# Altium schematic sheet OMD_F7_MCU.SchDoc
size A2; Organization: Altium Limited; Address1: L3, 12a Rodborough Rd; Address2: Frenchs Forest; Address3: NSW; Address4: Australia 2086
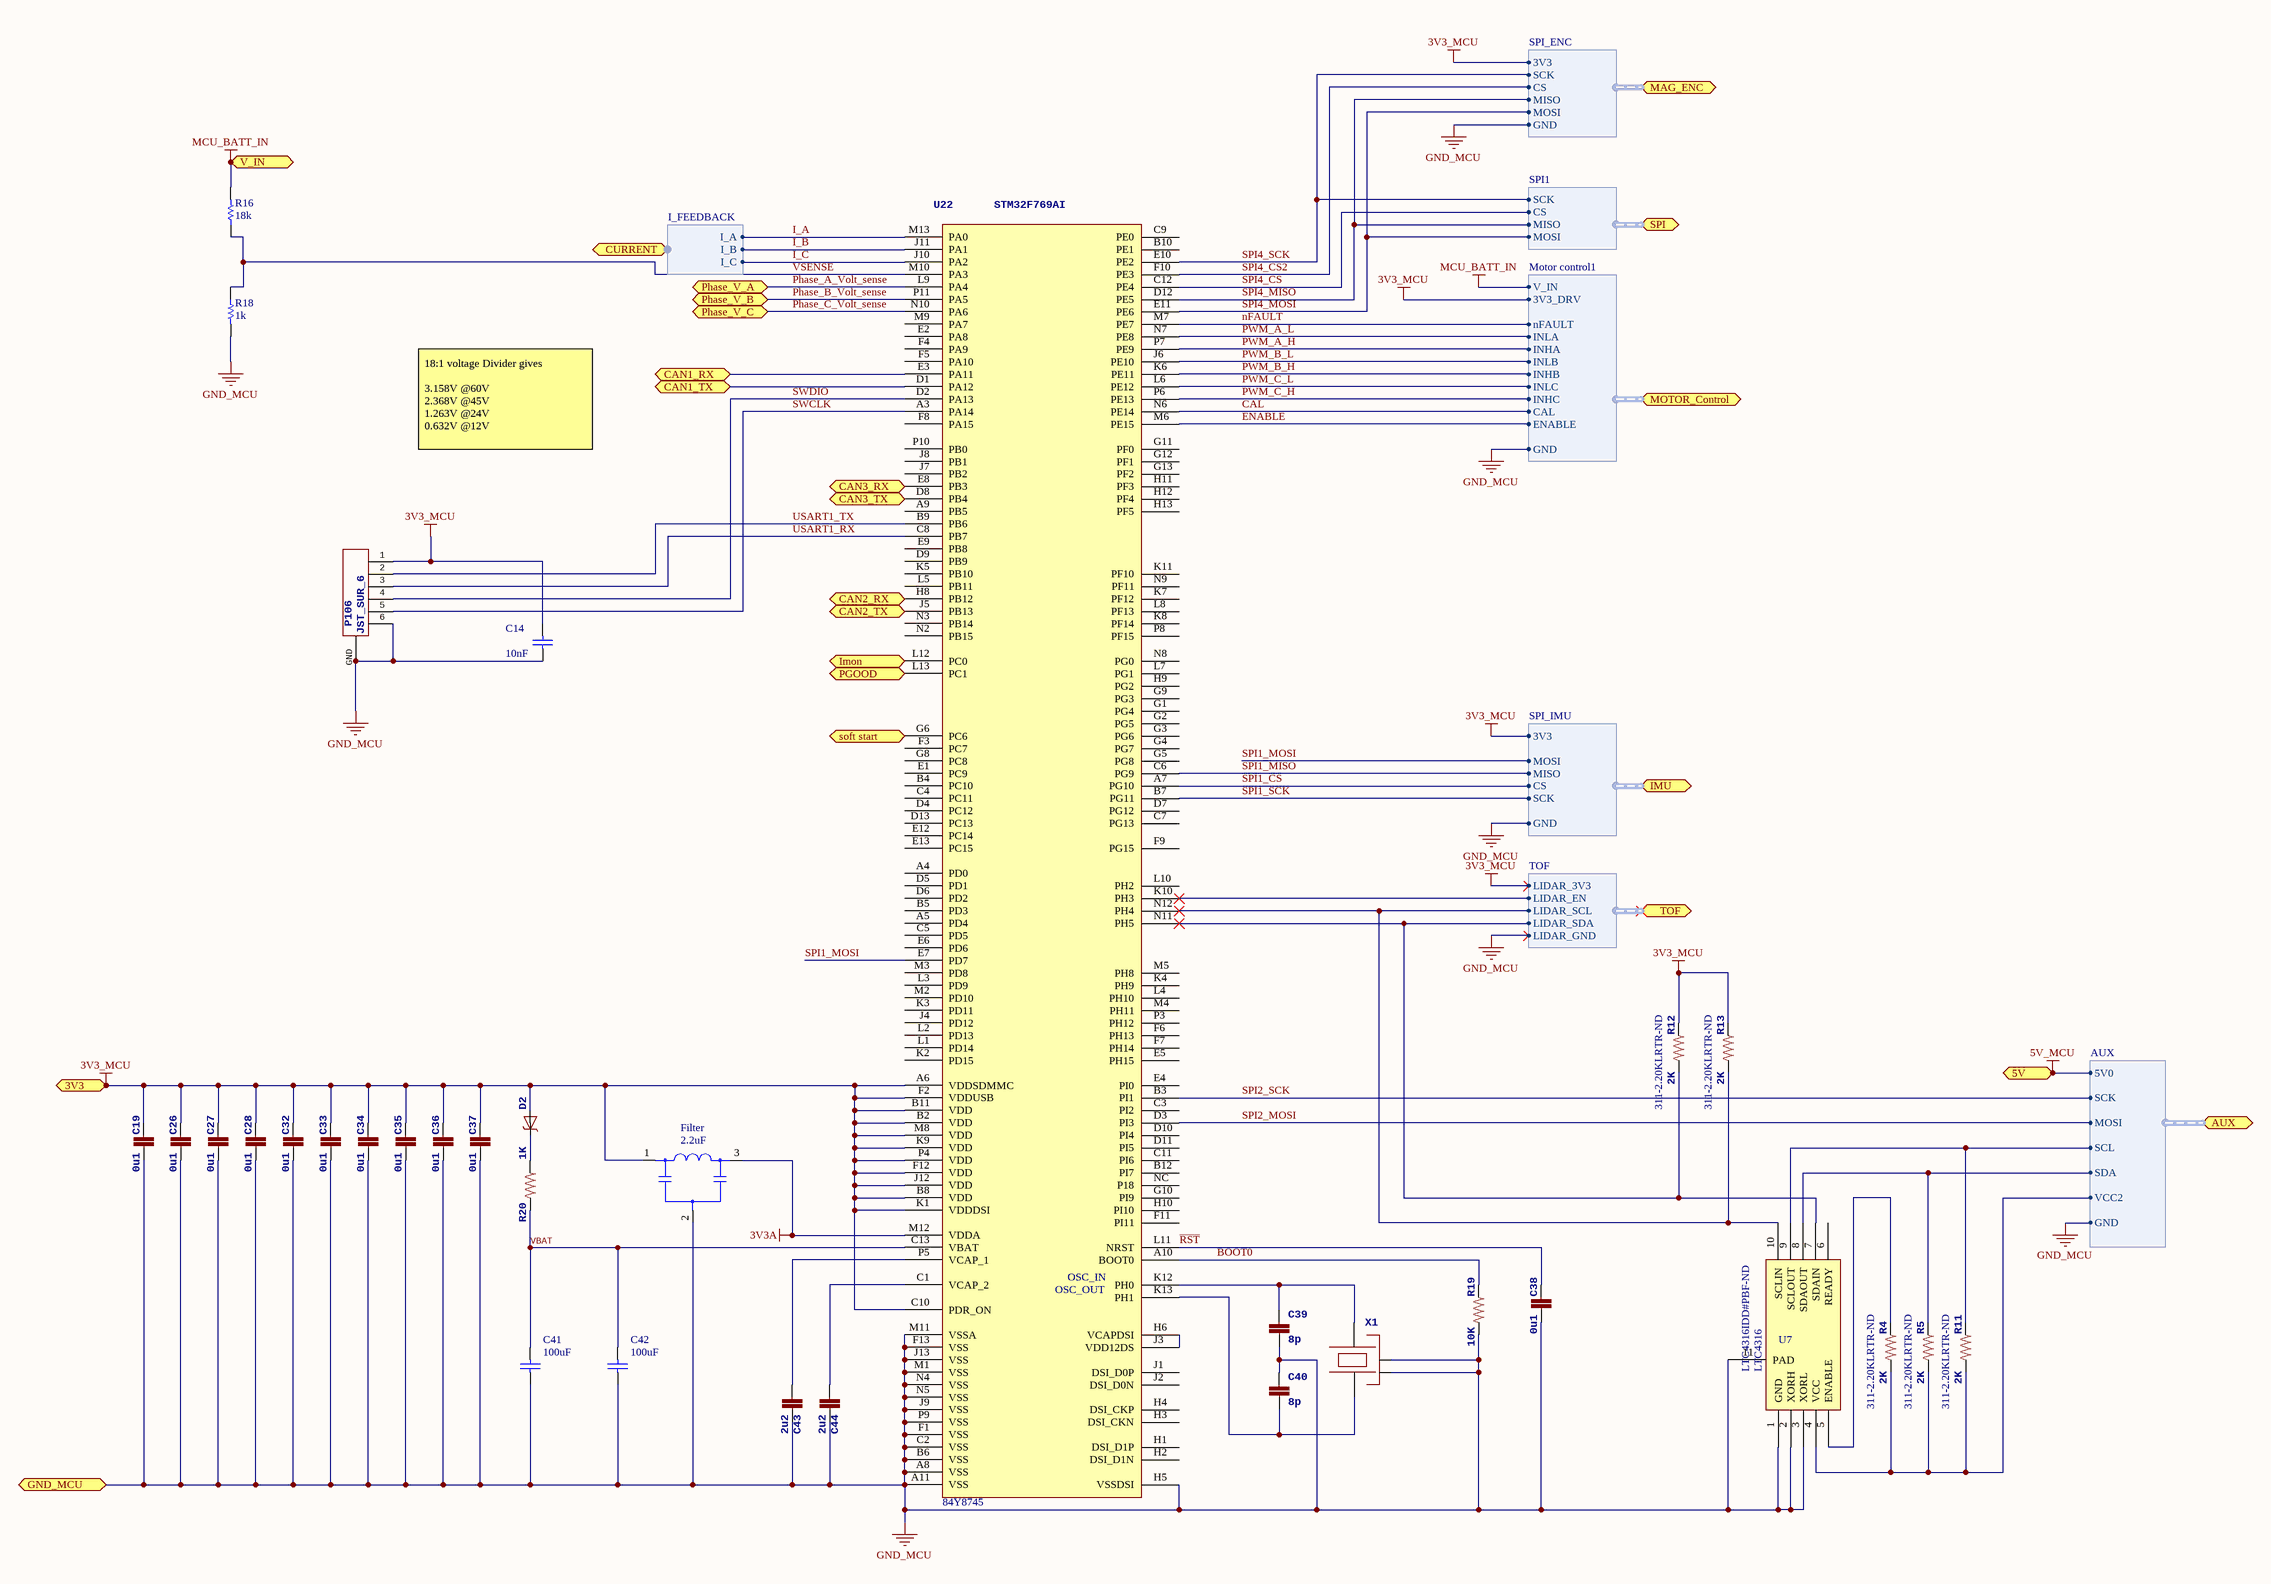
[diagram p0: OMD_F7_MCU.SchDoc]

## Parts
C14  value 10nF  [CAPC1005L]  (hidden comment: CAP CER 10000PF 50V X7R 0402)
C19  0u1  [0201-cap]
C26  0u1  [0201-cap]
C27  0u1  [0201-cap]
C28  0u1  [0201-cap]
C32  0u1  [0201-cap]
C33  0u1  [0201-cap]
C34  0u1  [0201-cap]
C35  0u1  [0201-cap]
C36  0u1  [0201-cap]
C37  0u1  [0201-cap]
C38  0u1  [0201-cap]
C39  8p  [0201-cap]
C40  8p  [0201-cap]
C41  value 100uF  [C0805]  (hidden comment: GRM21BR60G107ME15L)
C42  value 100uF  [C0805]  (hidden comment: GRM21BR60G107ME15L)
C43  2u2  [0201-cap]
C44  2u2  [0201-cap]
D2  Schottky barrier diode  [SOD323]  (value not drawn)
Filter  value 2.2uF  [NFM18CC]  (hidden comment: Filter)
P106  JST_SUR_6  [JST_SUR_H6]
R4  2K  Supplier Part Number 2: 311-2.20KLRTR-ND  [0402-RES]
R5  2K  Supplier Part Number 2: 311-2.20KLRTR-ND  [0402-RES]
R11  2K  Supplier Part Number 2: 311-2.20KLRTR-ND  [0402-RES]
R12  2K  Supplier Part Number 2: 311-2.20KLRTR-ND  [0402-RES]
R13  2K  Supplier Part Number 2: 311-2.20KLRTR-ND  [0402-RES]
R16  value 18k  [R0805]  (hidden comment: RES)
R18  value 1k  [R0805]  (hidden comment: RES)
R19  10K  [0402-RES]
R20  1K  [0402-RES]
U7  LTC4316  Supplier Part Number 1: LTC4316IDD#PBF-ND  [LTC4316]
U22  STM32F769AI  Supplier Part Number 1: 84Y8745  [WLCSP180]
X1  Crystal Oscillator in SMD 1.6 x 1.2  [OSCILLATOR-1.6x1.2]  (value not drawn)

## Ports
3V3, 5V, AUX (harness AUX), CAN1_RX, CAN1_TX, CAN2_RX, CAN2_TX, CAN3_RX, CAN3_TX, CURRENT (harness I_FEEDBACK), GND_MCU, Imon, IMU (harness SPI_IMU), MAG_ENC (harness SPI_ENC), MOTOR_Control (harness Motor control1), PGOOD, Phase_V_A, Phase_V_B, Phase_V_C, soft start, SPI (harness SPI1), TOF (harness TOF), V_IN

## Harnesses
Motor control1: 3V3_DRV, INHA, INLA, INHB, INLB, INHC, INLC, nFAULT, V_IN, GND, CAL, ENABLE
I_FEEDBACK: I_A, I_B, I_C
SPI1: SCK, MISO, MOSI, CS
SPI_IMU: SCK, MISO, MOSI, CS, 3V3, GND
SPI_ENC: SCK, MISO, MOSI, CS, 3V3, GND
AUX: SCK, MOSI, 5V0, GND, SCL, SDA, VCC2
TOF: LIDAR_3V3, LIDAR_SDA, LIDAR_SCL, LIDAR_GND, LIDAR_EN

## Nets
3V3_MCU: C14.2 C19.1 C26.1 C27.1 C28.1 C32.1 C33.1 C34.1 C35.1 C36.1 C37.1 D2.A Filter.1(IN) P106.1 R12.2 R13.2 U22.A6(VDDSDMMC) U22.B2(VDD) U22.B8(VDD) U22.B11(VDD) U22.C10(PDR_ON) U22.F2(VDDUSB) U22.F12(VDD) U22.J12(VDD) U22.K1(VDDDSI) U22.K9(VDD) U22.M8(VDD) U22.P4(VDD) ; port 3V3, port MOTOR_Control.3V3_DRV, port IMU.3V3, port MAG_ENC.3V3, port TOF.LIDAR_3V3
3V3A: Filter.3(OUT) U22.M12(VDDA)
5V_MCU: port 5V, port AUX.5V0
GND_MCU: C14.1 C19.2 C26.2 C27.2 C28.2 C32.2 C33.2 C34.2 C35.2 C36.2 C37.2 C38.2 C39.2 C40.1 C41.1 C42.1 C43.2 C44.2 Filter.2(GND) P106.6 P106.GND R18.2 R19.1 U7.1(GND) U7.2(XORH) U7.3(XORL) U7.11(PAD) U22.A8(VSS) U22.A11(VSS) U22.B6(VSS) U22.C2(VSS) U22.F1(VSS) U22.F13(VSS) U22.H5(VSSDSI) U22.J9(VSS) U22.J13(VSS) U22.M1(VSS) U22.M11(VSSA) U22.N4(VSS) U22.N5(VSS) U22.P9(VSS) X1.2(NC_2) X1.4(NC_4) ; port GND_MCU, port MOTOR_Control.GND, port IMU.GND, port MAG_ENC.GND, port AUX.GND, port TOF.LIDAR_GND
MCU_BATT_IN: R16.2 ; port V_IN, port MOTOR_Control.V_IN
BOOT0: R19.2 U22.A10(BOOT0)
CAL: U22.N6(PE14) ; port MOTOR_Control.CAL
CAN1_RX: U22.E3(PA11) ; port CAN1_RX
CAN1_TX: U22.D1(PA12) ; port CAN1_TX
CAN2_RX: U22.H8(PB12) ; port CAN2_RX
CAN2_TX: U22.J5(PB13) ; port CAN2_TX
CAN3_RX: U22.E8(PB3) ; port CAN3_RX
CAN3_TX: U22.D8(PB4) ; port CAN3_TX
ENABLE: U22.M6(PE15) ; port MOTOR_Control.ENABLE
I_A: U22.M13(PA0) ; port CURRENT.I_A
I_B: U22.J11(PA1) ; port CURRENT.I_B
I_C: U22.J10(PA2) ; port CURRENT.I_C
Imon: U22.L12(PC0) ; port Imon
nFAULT: U22.M7(PE7) ; port MOTOR_Control.nFAULT
PGOOD: U22.L13(PC1) ; port PGOOD
Phase_A_Volt_sense: U22.L9(PA4) ; port Phase_V_A
Phase_B_Volt_sense: U22.P11(PA5) ; port Phase_V_B
Phase_C_Volt_sense: U22.N10(PA6) ; port Phase_V_C
PWM_A_H: U22.P7(PE9) ; port MOTOR_Control.INHA
PWM_A_L: U22.N7(PE8) ; port MOTOR_Control.INLA
PWM_B_H: U22.K6(PE11) ; port MOTOR_Control.INHB
PWM_B_L: U22.J6(PE10) ; port MOTOR_Control.INLB
PWM_C_H: U22.P6(PE13) ; port MOTOR_Control.INHC
PWM_C_L: U22.L6(PE12) ; port MOTOR_Control.INLC
~{RST}: C38.1 U22.L11(NRST)
soft start: U22.G6(PC6) ; port soft start
SPI1_CS: U22.A7(PG10) ; port IMU.CS
SPI1_MISO: U22.C6(PG9) ; port IMU.MISO
SPI1_MOSI: U22.E7(PD7) ; port IMU.MOSI
SPI1_SCK: U22.B7(PG11) ; port IMU.SCK
SPI2_MOSI: U22.D3(PI3) ; port AUX.MOSI
SPI2_SCK: U22.B3(PI1) ; port AUX.SCK
SPI4_CS: U22.C12(PE4) ; port SPI.CS
SPI4_CS2: U22.F10(PE3) ; port MAG_ENC.CS
SPI4_MISO: U22.D12(PE5) ; port SPI.MISO, port MAG_ENC.MISO
SPI4_MOSI: U22.E11(PE6) ; port SPI.MOSI, port MAG_ENC.MOSI
SPI4_SCK: U22.E10(PE2) ; port SPI.SCK, port MAG_ENC.SCK
SWCLK: P106.5 U22.A3(PA14)
SWDIO: P106.4 U22.D2(PA13)
USART1_RX: P106.3 U22.C8(PB7)
USART1_TX: P106.2 U22.B9(PB6)
VBAT: C41.2 C42.2 R20.1 U22.C13(VBAT)
VSENSE: R16.1 R18.1 U22.M10(PA3)
NetC39_1: C39.1 U22.K12(PH0) X1.3
NetC40_2: C40.2 U22.K13(PH1) X1.1
NetC43_1: C43.1 U22.P5(VCAP_1)
NetC44_1: C44.1 U22.C1(VCAP_2)
NetD2_C: D2.C R20.2
NetR4_1: R4.1 R5.1 R11.1 U7.4(VCC) ; port AUX.VCC2
NetR4_2: R4.2 U7.5(ENABLE)
NetR5_2: R5.2 U7.8(SDAOUT) ; port AUX.SDA
NetR11_2: R11.2 U7.9(SCLOUT) ; port AUX.SCL
NetR12_1: R12.1 U7.7(SDAIN) U22.N11(PH5) ; port TOF.LIDAR_SDA
NetR13_1: R13.1 U7.10(SCLIN) U22.N12(PH4) ; port TOF.LIDAR_SCL
NetU22_H6: U22.H6(VCAPDSI) U22.J3(VDD12DS)
NetU22_K10: U22.K10(PH3) ; port TOF.LIDAR_EN

Not connected (* = marked no-connect by the designer): U7 6(READY); U22 A4(PD0) A5(PD4) A9(PB5) B4(PC10) B5(PD3) B10(PE1) B12(PI7) C3(PI2) C4(PC11) C5(PD5) C7(PG13) C9(PE0) C11(PI6) D4(PC12) D5(PD1) D6(PD2) D7(PG12) D9(PB9) D10(PI4) D11(PI5) D13(PC13) E1(PC9) E2(PA8) E4(PI0) E5(PH15) E6(PD6) E9(PB8) E12(PC14) E13(PC15) F3(PC7) F4(PA9) F5(PA10) F6(PH13) F7(PH14) F8(PA15) F9(PG15) F11(PI11) G1(PG4) G2(PG5) G3(PG6) G4(PG7) G5(PG8) G8(PC8) G9(PG3) G10(PI9) G11(PF0) G12(PF1) G13(PF2) H1(DSI_D1P) H2(DSI_D1N) H3(DSI_CKN) H4(DSI_CKP) H9(PG2) H10(PI10) H11(PF3) H12(PF4) H13(PF5) J1(DSI_D0P) J2(DSI_D0N) J4(PD12) J7(PB2) J8(PB1) K2(PD15) K3(PD11) K4(PH9) K5(PB10) K7(PF12) K8(PF14) K11(PF10) L1(PD14) L2(PD13) L3(PD9) L4(PH10) L5(PB11) L7(PG1) L8(PF13) L10(PH2) M2(PD10) M3(PD8) M4(PH11) M5(PH8) M9(PA7) N2(PB15) N3(PB14) N8(PG0) N9(PF11) NC(P18) P3(PH12) P8(PF15) P10(PB0)

## Notes on the sheet
- 18:1 voltage Divider gives
  3.158V @60V
  2.368V @45V
  1.263V @24V
  0.632V @12V
  worst case is 3S, which could risk noise that is unacceptable.
  Testing will determine this.
  it may require that we do a 3-8s, and an 8-10s version, with different resistors.
  This only affects Closed loop control, no effect on FOC
- https://github.com/OpenMotorDrive
- Title
- ProfiCNC Pty. Ltd.
- https://creativecommons.org/licenses/by-nc-sa/4.0/
- For Commercial use, please contact ProfiCNC
- ProfiCNC does NOT guaranty these drawings as fit for any purpose, you must verify this information before attempting to use it in any way.  USE AT OWN RISK
- Size:
- Date:
- File:
- A2
- Number:
- Time:
- Revision:
- Sheet
- of
- (in symbol STM32F769AI) OSC_IN; OSC_OUT

## Library data of the parts
C14 = Cap: Supplier 1: Digi-Key; Supplier Part Number 1: 445-6893-1-ND
C19 C26-C28 C32-C38 = CAP0402: CAP CER 0.1UF 6V Y5V 0201; Supplier 1: Digi-Key; Supplier Part Number 1: 490-10404-2-ND
C39 C40 = CAP0402: CAP CER 8PF 50V NP0 0201; Supplier 1: Digi-Key; Supplier Part Number 1: 490-13331-1-ND
C41 C42 = Capacitor: Supplier 1: Digi-Key; Supplier Part Number 1: 490-10510-1-ND
C43 C44 = CAP0402: CAP CER 2u2uF 6V Y5V 0201; Supplier 1: Digi-Key; Supplier Part Number 1: 490-13224-1-ND
D2 = DIODE-SCHOTTKY_SOD323: DIODE SCHOTTKY 30V 0.03A SOD323; Supplier 1: Digi-Key; Supplier Part Number 1: RB751V40T1GOSCT-ND; Value: 30V
Filter = NFM18CC222R1C3: EMIFIL (Capacitor type) Single Circuit Type for Signal Lines; Supplier 1: Digi-Key; Supplier Part Number 1: 490-6972-1-ND
P106 = JST_SUR_6: Connector, Header, 6Pos, .8mm IDC, R/A, SMD, Tin; Supplier 1: Digi-Key; Supplier Part Number 1: SM06B-SURS-TF(LF)(SN)-ND
R4 R5 R11-R13 = RESISTOR0402-RES: RES 2K OHM 1/16W 1% 0402 SMD; Supplier 1: Digi-Key; Supplier Part Number 1: 311-2.0KLRCT-ND; Supplier 2: Digi-Key
R16 = R00155: RES SMD 18K OHM 1% 1/8W 0805; Supplier 1: Digi-Key; Supplier Part Number 1: 311-18.0KCRCT-ND
R18 = R00095: RES SMD 1K OHM 1% 1/8W 0805; Supplier 1: Digi-Key; Supplier Part Number 1: 311-1.00KCRCT-ND
R19 = RESISTOR0402-RES: RES 10K OHM 1/16W 1% 0402 SMD; Supplier 1: Digi-Key; Supplier Part Number 1: 311-10.0KLRCT-ND
R20 = RESISTOR0402-RES: RES 1K OHM 1/16W 1% 0402; Supplier 1: Digi-Key; Supplier Part Number 1: 1276-3430-1-ND; Value: 1K
U22 = STM32F769AI: STM32F7; Supplier 1: Newark
X1 = OSCILLATOR-3.2X2.5: CRYSTAL 24MHZ 8PF SMD; Supplier 1: Digi-Key; Supplier Part Number 1: 887-1846-2-ND
U7 = LTC4316: Supplier 1: Digi-Key